# Altium project STM32F303VCT6_PLC.PrjPcb (part 2 of 2)

## Sheet 08_INPUTCAPTURE_ENCODER.SchDoc
size 420 x 297 mm; SheetNumber: 8; SheetTotal: 12
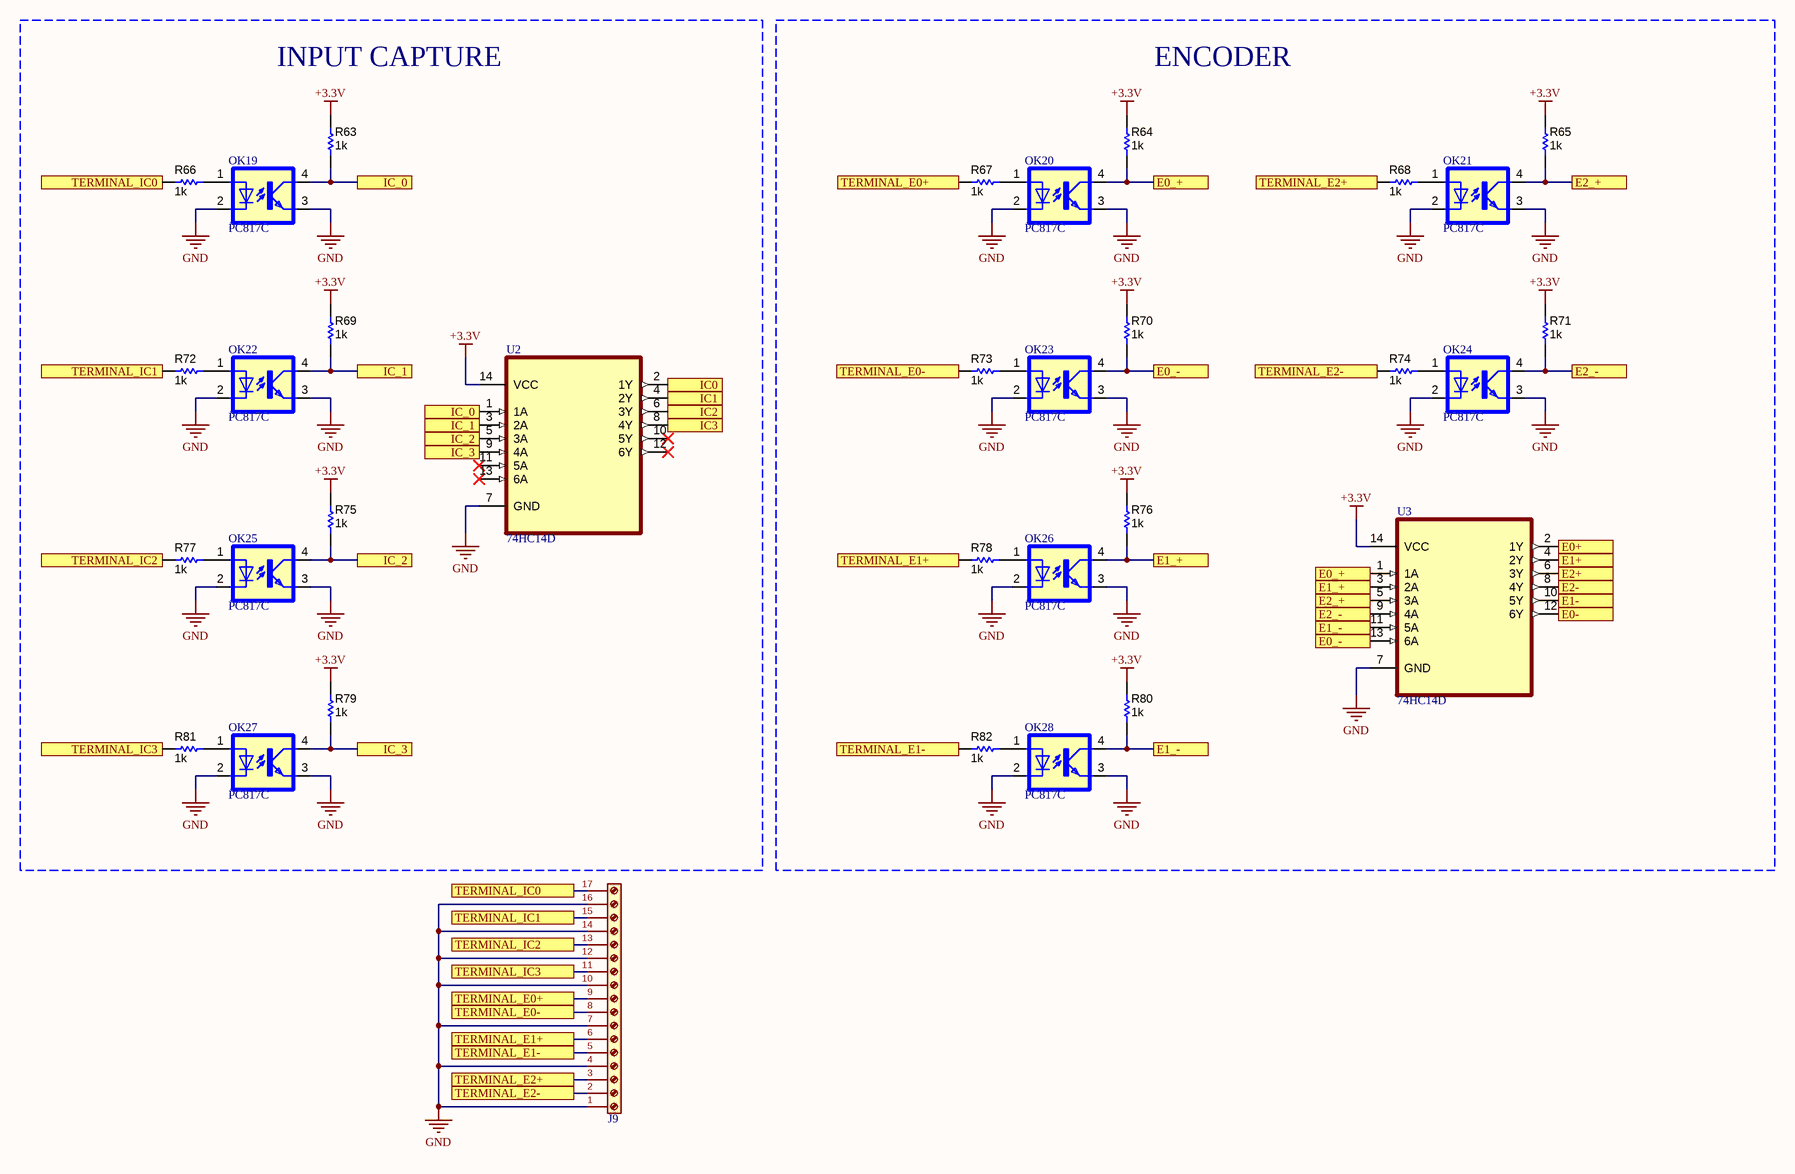
[diagram p5: 08_INPUTCAPTURE_ENCODER.SchDoc]

### Parts
J9  Terminal_01x17_P5.00  [TerminalBlock_Phoenix_PT-1,5-17-5.0-H_1x17_P5.00mm_Horizontal]  (value not drawn)
OK19  PC817C  [SOP254P975X460-4N]
OK20  PC817C  [SOP254P975X460-4N]
OK21  PC817C  [SOP254P975X460-4N]
OK22  PC817C  [SOP254P975X460-4N]
OK23  PC817C  [SOP254P975X460-4N]
OK24  PC817C  [SOP254P975X460-4N]
OK25  PC817C  [SOP254P975X460-4N]
OK26  PC817C  [SOP254P975X460-4N]
OK27  PC817C  [SOP254P975X460-4N]
OK28  PC817C  [SOP254P975X460-4N]
R63  ValueDisplayed: 1k  [0603]  (hidden comment: MCT06030Z0000ZP500)
R64  ValueDisplayed: 1k  [0603]  (hidden comment: MCT06030Z0000ZP500)
R65  ValueDisplayed: 1k  [0603]  (hidden comment: MCT06030Z0000ZP500)
R66  ValueDisplayed: 1k  [0603]  (hidden comment: MCT06030Z0000ZP500)
R67  ValueDisplayed: 1k  [0603]  (hidden comment: MCT06030Z0000ZP500)
R68  ValueDisplayed: 1k  [0603]  (hidden comment: MCT06030Z0000ZP500)
R69  ValueDisplayed: 1k  [0603]  (hidden comment: MCT06030Z0000ZP500)
R70  ValueDisplayed: 1k  [0603]  (hidden comment: MCT06030Z0000ZP500)
R71  ValueDisplayed: 1k  [0603]  (hidden comment: MCT06030Z0000ZP500)
R72  ValueDisplayed: 1k  [0603]  (hidden comment: MCT06030Z0000ZP500)
R73  ValueDisplayed: 1k  [0603]  (hidden comment: MCT06030Z0000ZP500)
R74  ValueDisplayed: 1k  [0603]  (hidden comment: MCT06030Z0000ZP500)
R75  ValueDisplayed: 1k  [0603]  (hidden comment: MCT06030Z0000ZP500)
R76  ValueDisplayed: 1k  [0603]  (hidden comment: MCT06030Z0000ZP500)
R77  ValueDisplayed: 1k  [0603]  (hidden comment: MCT06030Z0000ZP500)
R78  ValueDisplayed: 1k  [0603]  (hidden comment: MCT06030Z0000ZP500)
R79  ValueDisplayed: 1k  [0603]  (hidden comment: MCT06030Z0000ZP500)
R80  ValueDisplayed: 1k  [0603]  (hidden comment: MCT06030Z0000ZP500)
R81  ValueDisplayed: 1k  [0603]  (hidden comment: MCT06030Z0000ZP500)
R82  ValueDisplayed: 1k  [0603]  (hidden comment: MCT06030Z0000ZP500)
U2  74HC14D  [SOIC127P600X175-14N]
U3  74HC14D  [SOIC127P600X175-14N]

### Blocks framed on the sheet
INPUT CAPTURE: OK19 OK22 OK25 OK27 R63 R66 R69 R72 R75 R77 R79 R81 U2
ENCODER: OK20 OK21 OK23 OK24 OK26 OK28 R64 R65 R67 R68 R70 R71 R73 R74 R76 R78 R80 R82 U3

### Ports
E0+ (see 04_STM32F303VCT6[3C]), E0- (see 04_STM32F303VCT6[3B]), E0_+ (see 08_INPUTCAPTURE_ENCODER[4A]), E0_+ (see 08_INPUTCAPTURE_ENCODER[4B]), E0_- (see 08_INPUTCAPTURE_ENCODER[4B]), E1+ (see 04_STM32F303VCT6[5B]), E1- (see 04_STM32F303VCT6[5B]), E1_+ (see 08_INPUTCAPTURE_ENCODER[4B]), E1_- (see 08_INPUTCAPTURE_ENCODER[4B]), E2+ (see 04_STM32F303VCT6[5B]), E2- (see 04_STM32F303VCT6[5B]), E2_+ (see 08_INPUTCAPTURE_ENCODER[4B]), E2_+ (see 08_INPUTCAPTURE_ENCODER[5A]), E2_- (see 08_INPUTCAPTURE_ENCODER[4B]), E2_- (see 08_INPUTCAPTURE_ENCODER[5B]), IC0 (see 04_STM32F303VCT6[3C]), IC1 (see 04_STM32F303VCT6[3C]), IC2 (see 04_STM32F303VCT6[3B]), IC3 (see 04_STM32F303VCT6[3B]), IC_0 (see 08_INPUTCAPTURE_ENCODER[2A]), IC_0 (see 08_INPUTCAPTURE_ENCODER[2B]), IC_1 (see 08_INPUTCAPTURE_ENCODER[2B]), IC_2 (see 08_INPUTCAPTURE_ENCODER[2B]), IC_3 (see 08_INPUTCAPTURE_ENCODER[2B]), TERMINAL_E0+ (see 08_INPUTCAPTURE_ENCODER[2C]), TERMINAL_E0+ (see 08_INPUTCAPTURE_ENCODER[3A]), TERMINAL_E0- (see 08_INPUTCAPTURE_ENCODER[2C]), TERMINAL_E0- (see 08_INPUTCAPTURE_ENCODER[3B]), TERMINAL_E1+ (see 08_INPUTCAPTURE_ENCODER[2C]), TERMINAL_E1+ (see 08_INPUTCAPTURE_ENCODER[3B]), TERMINAL_E1- (see 08_INPUTCAPTURE_ENCODER[2C]), TERMINAL_E1- (see 08_INPUTCAPTURE_ENCODER[3B]), TERMINAL_E2+ (see 08_INPUTCAPTURE_ENCODER[2C]), TERMINAL_E2+ (see 08_INPUTCAPTURE_ENCODER[4A]), TERMINAL_E2- (see 08_INPUTCAPTURE_ENCODER[2C]), TERMINAL_E2- (see 08_INPUTCAPTURE_ENCODER[4B]), TERMINAL_IC0 (see 08_INPUTCAPTURE_ENCODER[1A]), TERMINAL_IC0 (see 08_INPUTCAPTURE_ENCODER[2C]), TERMINAL_IC1 (see 08_INPUTCAPTURE_ENCODER[1B]), TERMINAL_IC1 (see 08_INPUTCAPTURE_ENCODER[2C]), TERMINAL_IC2 (see 08_INPUTCAPTURE_ENCODER[1B]), TERMINAL_IC2 (see 08_INPUTCAPTURE_ENCODER[2C]), TERMINAL_IC3 (see 08_INPUTCAPTURE_ENCODER[1B]), TERMINAL_IC3 (see 08_INPUTCAPTURE_ENCODER[2C])

### Nets
+3.3V: R63.2 R64.2 R65.2 R69.2 R70.2 R71.2 R75.2 R76.2 R79.2 R80.2 U2.14(VCC) U3.14(VCC)
GND: J9.1(Pin_1) J9.4(Pin_4) J9.7(Pin_7) J9.10(Pin_10) J9.12(Pin_12) J9.14(Pin_14) J9.16(Pin_16) OK19.2(C) OK19.3(EMIT) OK20.2(C) OK20.3(EMIT) OK21.2(C) OK21.3(EMIT) OK22.2(C) OK22.3(EMIT) OK23.2(C) OK23.3(EMIT) OK24.2(C) OK24.3(EMIT) OK25.2(C) OK25.3(EMIT) OK26.2(C) OK26.3(EMIT) OK27.2(C) OK27.3(EMIT) OK28.2(C) OK28.3(EMIT) U2.7(GND) U3.7(GND)
E0+: U3.2(1Y) ; port E0+
E0-: U3.12(6Y) ; port E0-
E0_+: OK20.4(COL) R64.1 U3.1(1A) ; port E0_+
E0_-: OK23.4(COL) R70.1 U3.13(6A) ; port E0_-
E1+: U3.4(2Y) ; port E1+
E1-: U3.10(5Y) ; port E1-
E1_+: OK26.4(COL) R76.1 U3.3(2A) ; port E1_+
E1_-: OK28.4(COL) R80.1 U3.11(5A) ; port E1_-
E2+: U3.6(3Y) ; port E2+
E2-: U3.8(4Y) ; port E2-
E2_+: OK21.4(COL) R65.1 U3.5(3A) ; port E2_+
E2_-: OK24.4(COL) R71.1 U3.9(4A) ; port E2_-
IC0: U2.2(1Y) ; port IC0
IC1: U2.4(2Y) ; port IC1
IC2: U2.6(3Y) ; port IC2
IC3: U2.8(4Y) ; port IC3
IC_0: OK19.4(COL) R63.1 U2.1(1A) ; port IC_0
IC_1: OK22.4(COL) R69.1 U2.3(2A) ; port IC_1
IC_2: OK25.4(COL) R75.1 U2.5(3A) ; port IC_2
IC_3: OK27.4(COL) R79.1 U2.9(4A) ; port IC_3
TERMINAL_E0+: J9.9(Pin_9) R67.1 ; port TERMINAL_E0+
TERMINAL_E0-: J9.8(Pin_8) R73.1 ; port TERMINAL_E0-
TERMINAL_E1+: J9.6(Pin_6) R78.1 ; port TERMINAL_E1+
TERMINAL_E1-: J9.5(Pin_5) R82.1 ; port TERMINAL_E1-
TERMINAL_E2+: J9.3(Pin_3) R68.1 ; port TERMINAL_E2+
TERMINAL_E2-: J9.2(Pin_2) R74.1 ; port TERMINAL_E2-
TERMINAL_IC0: J9.17(Pin_17) R66.1 ; port TERMINAL_IC0
TERMINAL_IC1: J9.15(Pin_15) R72.1 ; port TERMINAL_IC1
TERMINAL_IC2: J9.13(Pin_13) R77.1 ; port TERMINAL_IC2
TERMINAL_IC3: J9.11(Pin_11) R81.1 ; port TERMINAL_IC3
NetOK19_1: OK19.1(A) R66.2
NetOK20_1: OK20.1(A) R67.2
NetOK21_1: OK21.1(A) R68.2
NetOK22_1: OK22.1(A) R72.2
NetOK23_1: OK23.1(A) R73.2
NetOK24_1: OK24.1(A) R74.2
NetOK25_1: OK25.1(A) R77.2
NetOK26_1: OK26.1(A) R78.2
NetOK27_1: OK27.1(A) R81.2
NetOK28_1: OK28.1(A) R82.2

Not connected (* = marked no-connect by the designer): U2 10(5Y)* 11(5A)* 12(6Y)* 13(6A)*

### Notes on the sheet
- Sub-system:
- Project:
- Design by:
- Sheet title:
- Sheet
- of
- Checked by:
- Approved by:
- Doc No:
- Revision:
- Size:
- Date:
- A3

### Library data of the parts
OK19-OK28 = PC817C: RF Mixer IC Cellular, DCS, PCS, W-CDMA, WLAN Up Converter 50MHz ~ 400MHz 6-SuperMiniMold; MF: Renesas Electronics America Inc; MP: PC817; SnapEDA_Link: https://www.snapeda.com/parts/PC817/Renesas/view-part/?ref=snap; Package: None; Value: *; Check_prices: https://www.snapeda.com/parts/PC817/Renesas/view-part/?ref=eda
R63-R82 = RES 0R 0603: RES, 0, 5%, 0.125 W, 0603; Manufacturer: Vishay/Beyschlag; Power_W: 125mW; TempCo: ppm/C; Value_Code: 0000; U/M: EA; Value: 0; EIA_Code: E24; SizeX_mm: 1.6; SizeY_mm: 0.8; SizeZ_mm: 1; Value2: 0.125W; SizeArea_mm2: 1.28; CompType: Resistor; AEC Qualified: N; AEC Category: Q200; Supplier Part Number 2: 96Y9454; Publisher: Texas Instruments; Supplier 2: Newark; Supplier Part Number 3: 594-MCT06030Z0000ZP5; Supplier 3: Mouser; Published: 2008-06-26; RoHS: Y; Value1: 5%; MountType: SMT; Supplier 1: Digi-Key; PackageReference: 0603; Tolerance_%: 5%; Res_ohm: 0; LatestRevisionDate: 2017-03-09; PartNumber: MCT06030Z0000ZP500; ComponentLink1Description: Datasheet link; AEC Grade: N/A; Supplier Part Number 1: MCT0603-0.0-ZZCT-ND; Technology: Thin Film; ComponentLink1URL: http://www.vishay.com/docs/28705/mcx0x0xpro.pdf
U2 U3 = 74HC14D: Inverter IC 6 Channel Schmitt Trigger 14-SOIC; MF: Toshiba; SnapEDA_Link: https://www.snapeda.com/parts/74HC14D/Toshiba/view-part/?ref=snap; Package: SO14-14 Nexperia USA Inc.; Value: *; MP: 74HC14D; Check_prices: https://www.snapeda.com/parts/74HC14D/Toshiba/view-part/?ref=eda

## Sheet 09_CAN.SchDoc
size 420 x 297 mm; SheetNumber: 9; SheetTotal: 12
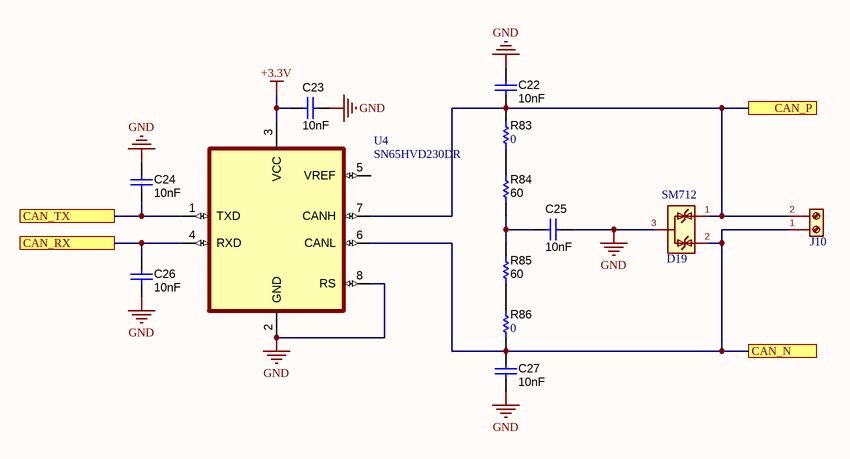
[diagram p6: 09_CAN.SchDoc]

### Parts
C22  ValueDisplayed: 10nF  [0603]  (hidden comment: CAP 10nF 0603)
C23  ValueDisplayed: 10nF  [0603]  (hidden comment: CAP 10nF 0603)
C24  ValueDisplayed: 10nF  [0603]  (hidden comment: CAP 10nF 0603)
C25  ValueDisplayed: 10nF  [0603]  (hidden comment: CAP 10nF 0603)
C26  ValueDisplayed: 10nF  [0603]  (hidden comment: CAP 10nF 0603)
C27  ValueDisplayed: 10nF  [0603]  (hidden comment: CAP 10nF 0603)
D19  SM712  [SOT-23]
J10  Terminal_01x02_P5.00  [TerminalBlock_Phoenix_PT-1,5-2-5.0-H_1x02_P5.00mm_Horizontal]  (value not drawn)
R83  ValueDisplayed: 0  [0402L]  (hidden comment: ERJ-2GE0R00X)
R84  ValueDisplayed: 60  [0603]  (hidden comment: MCT06030Z0000ZP500)
R85  ValueDisplayed: 60  [0603]  (hidden comment: MCT06030Z0000ZP500)
R86  ValueDisplayed: 0  [0402L]  (hidden comment: ERJ-2GE0R00X)
U4  SN65HVD230DR  [SOIC127P599X175-8N]

### Ports
CAN_N, CAN_P, CAN_RX (see 04_STM32F303VCT6[6C]), CAN_TX (see 04_STM32F303VCT6[6C])

### Nets
+3.3V: C23.2 U4.3(VCC)
GND: C22.1 C23.1 C24.1 C25.1 C26.2 C27.2 D19.3(A) U4.2(GND) U4.8(RS)
CAN_N: C27.1 D19.2(K) J10.1(Pin_1) R86.1 U4.6(CANL) ; port CAN_N
CAN_P: C22.2 D19.1(K) J10.2(Pin_2) R83.2 U4.7(CANH) ; port CAN_P
CAN_RX: C26.1 U4.4(RXD) ; port CAN_RX
CAN_TX: C24.2 U4.1(TXD) ; port CAN_TX
NetC25_2: C25.2 R84.1 R85.2
NetR83_1: R83.1 R84.2
NetR85_1: R85.1 R86.2

Not connected (* = marked no-connect by the designer): U4 5(VREF)

### Notes on the sheet
- Sub-system:
- Project:
- Design by:
- Sheet title:
- Sheet
- of
- Checked by:
- Approved by:
- Doc No:
- Revision:
- Size:
- Date:
- A3

### Library data of the parts
C22-C27 = CAP 10nF 0603: CAP, CERM, 10 nF, 50 V, +/- 10%, X7R, AEC-Q200 Grade 1, 0603; Manufacturer: MuRata; PartNumber: GCM188R70J225KE22D; TaMin_C: -55°C; Polarized: N; SizeAreaWB_mm2: 4.68; Value1: Unknown; U/M: EA; Value: 2.2uF; TaMax_C: 125°C; SizeZ_mm: 1; SizeX_mm: 1.6; SizeY_mm: 0.8; Value2: 6.3V; SizeArea_mm2: 1.28; CompType: Capacitor; AEC Qualified: Y; Cap_F: 2.2µF; AEC Category: Q200; Supplier Part Number 2: 81-GCM188R70J225KE2D; Publisher: Texas Instruments; Supplier 2: Mouser; TempCo: X7R; Published: 2008-06-19; RoHS: Y; MountType: SMT; Supplier 1: Digi-Key; PackageReference: 0603; Tolerance_%: 10%; Cap_Case: 0603; LatestRevisionDate: 2017-03-09; VDC_V: 6.3V; ComponentLink1Description: Datasheet link; AEC Grade: 1; Supplier Part Number 1: 490-5316-1-ND; Technology: Ceramic; ComponentLink1URL: http://psearch.en.murata.com/capacitor/product/GCM188R70J225KE22%23.pdf
D19 = PESD5V0L2BT,215
R83 R86 = RES 0R 0402 0.1W: RES, 0, 5%, 0.1 W, AEC-Q200 Grade 0, 0402; Manufacturer: Panasonic; Power_W: 100mW; TempCo: 600 ppm/C; Value_Code: 0000; Value: 0; EIA_Code: E24; SizeX_mm: 1; SizeY_mm: 0.5; SizeZ_mm: 0.6; Value2: 0.1W; CompType: Resistor; AEC Qualified: Y; VDC_V: 50V; AEC Category: Q200; SizeAreaWB_mm2: 3; Supplier Part Number 2: 65T8307; Supplier 2: Newark; Supplier Part Number 3: 667-ERJ-2GE0R00X; Supplier 3: Mouser; RoHS: Y; Value1: 5%; MountType: SMT; Supplier 1: Digi-Key; PackageReference: 0402; Tolerance_%: 5%; Res_ohm: 0; SizeArea_mm2: 0.5; PartNumber: ERJ-2GE0R00X; ComponentLink1Description: Datasheet link; Supplier Part Number 1: P0.0JCT-ND; Technology: Thick Film; ComponentLink1URL: https://industrial.panasonic.com/cdbs/www-data/pdf/RDA0000/AOA0000C301.pdf; AEC Grade: 0
R84 R85 = RES 60R 0603: RES, 60, 5%, 0.125 W, 0603; Manufacturer: Vishay/Beyschlag; Power_W: 125mW; TempCo: ppm/C; Value_Code: 0000; U/M: EA; Value: 0; EIA_Code: E24; SizeX_mm: 1.6; SizeY_mm: 0.8; SizeZ_mm: 1; Value2: 0.125W; SizeArea_mm2: 1.28; CompType: Resistor; AEC Qualified: N; AEC Category: Q200; Supplier Part Number 2: 96Y9454; Publisher: Texas Instruments; Supplier 2: Newark; Supplier Part Number 3: 594-MCT06030Z0000ZP5; Supplier 3: Mouser; Published: 2008-06-26; RoHS: Y; Value1: 5%; MountType: SMT; Supplier 1: Digi-Key; PackageReference: 0603; Tolerance_%: 5%; Res_ohm: 0; LatestRevisionDate: 2017-03-09; PartNumber: MCT06030Z0000ZP500; ComponentLink1Description: Datasheet link; AEC Grade: N/A; Supplier Part Number 1: MCT0603-0.0-ZZCT-ND; Technology: Thin Film; ComponentLink1URL: http://www.vishay.com/docs/28705/mcx0x0xpro.pdf
U4 = SN65HVD230DR_1: 3.3-V CAN Transceivers; MF: Texas Instruments; MP: TCAN332DR; SnapEDA_Link: https://www.snapeda.com/parts/TCAN332DR/Texas+Instruments/view-part/?ref=snap; Package: SOIC-8 Texas Instruments; Value: *; Check_prices: https://www.snapeda.com/parts/TCAN332DR/Texas+Instruments/view-part/?ref=eda

## Sheet 10_ADC.SchDoc
size 420 x 297 mm; SheetNumber: 10; SheetTotal: 12
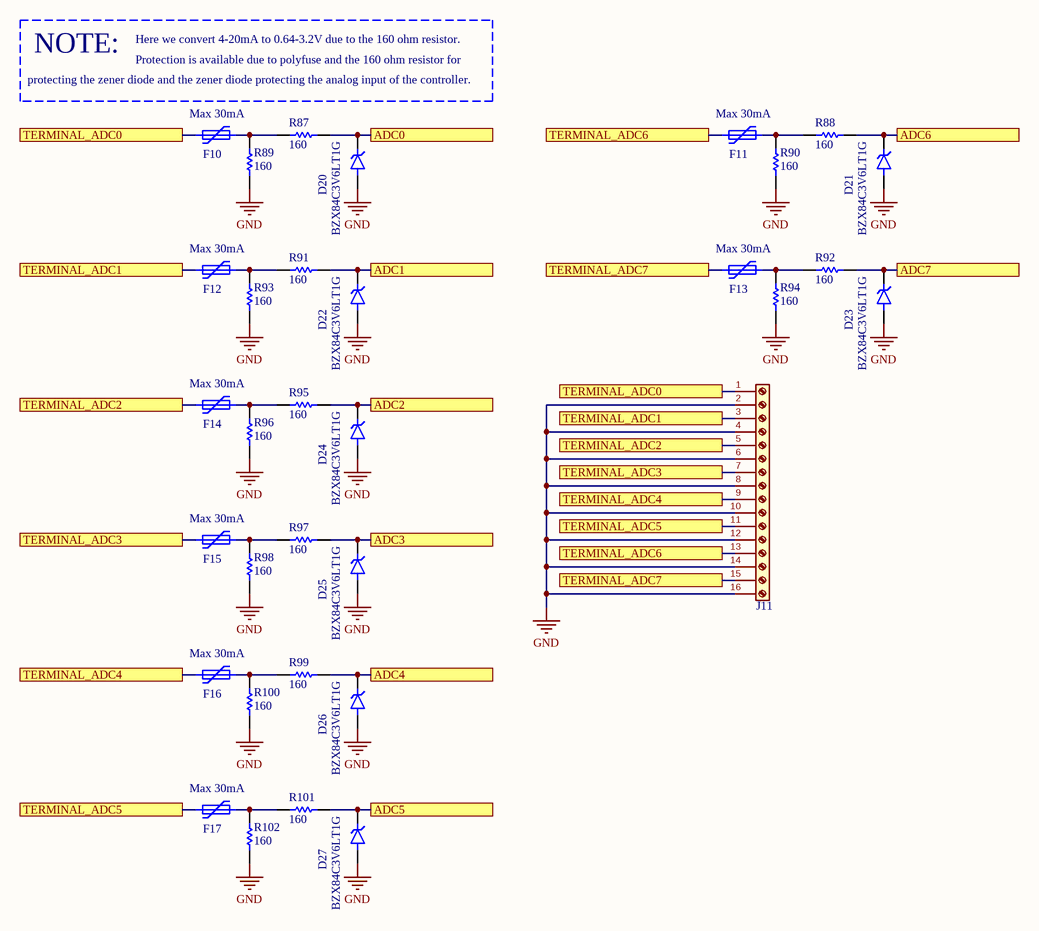
[diagram p7: 10_ADC.SchDoc]

### Parts
D20  BZX84C3V6LT1G  [SOT95P240X111-3N]
D21  BZX84C3V6LT1G  [SOT95P240X111-3N]
D22  BZX84C3V6LT1G  [SOT95P240X111-3N]
D23  BZX84C3V6LT1G  [SOT95P240X111-3N]
D24  BZX84C3V6LT1G  [SOT95P240X111-3N]
D25  BZX84C3V6LT1G  [SOT95P240X111-3N]
D26  BZX84C3V6LT1G  [SOT95P240X111-3N]
D27  BZX84C3V6LT1G  [SOT95P240X111-3N]
F10  Max 30mA  [Fuse_0603_1608Metric]
F11  Max 30mA  [Fuse_0603_1608Metric]
F12  Max 30mA  [Fuse_0603_1608Metric]
F13  Max 30mA  [Fuse_0603_1608Metric]
F14  Max 30mA  [Fuse_0603_1608Metric]
F15  Max 30mA  [Fuse_0603_1608Metric]
F16  Max 30mA  [Fuse_0603_1608Metric]
F17  Max 30mA  [Fuse_0603_1608Metric]
J11  Terminal_01x16_P5.00  [TerminalBlock_Phoenix_PT-1,5-16-5.0-H_1x16_P5.00mm_Horizontal]  (value not drawn)
R87  ValueDisplayed: 160  [0603]  (hidden comment: CRCW060320R0JNEA)
R88  ValueDisplayed: 160  [0603]  (hidden comment: CRCW060320R0JNEA)
R89  ValueDisplayed: 160  [0603]  (hidden comment: CRCW060320R0JNEA)
R90  ValueDisplayed: 160  [0603]  (hidden comment: CRCW060320R0JNEA)
R91  ValueDisplayed: 160  [0603]  (hidden comment: CRCW060320R0JNEA)
R92  ValueDisplayed: 160  [0603]  (hidden comment: CRCW060320R0JNEA)
R93  ValueDisplayed: 160  [0603]  (hidden comment: CRCW060320R0JNEA)
R94  ValueDisplayed: 160  [0603]  (hidden comment: CRCW060320R0JNEA)
R95  ValueDisplayed: 160  [0603]  (hidden comment: CRCW060320R0JNEA)
R96  ValueDisplayed: 160  [0603]  (hidden comment: CRCW060320R0JNEA)
R97  ValueDisplayed: 160  [0603]  (hidden comment: CRCW060320R0JNEA)
R98  ValueDisplayed: 160  [0603]  (hidden comment: CRCW060320R0JNEA)
R99  ValueDisplayed: 160  [0603]  (hidden comment: CRCW060320R0JNEA)
R100  ValueDisplayed: 160  [0603]  (hidden comment: CRCW060320R0JNEA)
R101  ValueDisplayed: 160  [0603]  (hidden comment: CRCW060320R0JNEA)
R102  ValueDisplayed: 160  [0603]  (hidden comment: CRCW060320R0JNEA)

### Ports
ADC0 (see 04_STM32F303VCT6[3B]), ADC1 (see 04_STM32F303VCT6[3B]), ADC2 (see 04_STM32F303VCT6[3B]), ADC3 (see 04_STM32F303VCT6[2B]), ADC4 (see 04_STM32F303VCT6[2B]), ADC5 (see 04_STM32F303VCT6[2B]), ADC6 (see 04_STM32F303VCT6[2B]), ADC7 (see 04_STM32F303VCT6[2B]), TERMINAL_ADC0 (see 10_ADC[1A]), TERMINAL_ADC0 (see 10_ADC[2B]), TERMINAL_ADC1 (see 10_ADC[1A]), TERMINAL_ADC1 (see 10_ADC[2B]), TERMINAL_ADC2 (see 10_ADC[1B]), TERMINAL_ADC2 (see 10_ADC[2B]), TERMINAL_ADC3 (see 10_ADC[1B]), TERMINAL_ADC3 (see 10_ADC[2B]), TERMINAL_ADC4 (see 10_ADC[1B]), TERMINAL_ADC4 (see 10_ADC[2B]), TERMINAL_ADC5 (see 10_ADC[1C]), TERMINAL_ADC5 (see 10_ADC[2B]), TERMINAL_ADC6 (see 10_ADC[2A]), TERMINAL_ADC6 (see 10_ADC[2B]), TERMINAL_ADC7 (see 10_ADC[2A]), TERMINAL_ADC7 (see 10_ADC[2B])

### Nets
GND: D20.1(A) D21.1(A) D22.1(A) D23.1(A) D24.1(A) D25.1(A) D26.1(A) D27.1(A) J11.2(Pin_2) J11.4(Pin_4) J11.6(Pin_6) J11.8(Pin_8) J11.10(Pin_10) J11.12(Pin_12) J11.14(Pin_14) J11.16(Pin_16) R89.1 R90.1 R93.1 R94.1 R96.1 R98.1 R100.1 R102.1
ADC0: D20.3(K) R87.2 ; port ADC0
ADC1: D22.3(K) R91.2 ; port ADC1
ADC2: D24.3(K) R95.2 ; port ADC2
ADC3: D25.3(K) R97.2 ; port ADC3
ADC4: D26.3(K) R99.2 ; port ADC4
ADC5: D27.3(K) R101.2 ; port ADC5
ADC6: D21.3(K) R88.2 ; port ADC6
ADC7: D23.3(K) R92.2 ; port ADC7
TERMINAL_ADC0: F10.1 J11.1(Pin_1) ; port TERMINAL_ADC0
TERMINAL_ADC1: F12.1 J11.3(Pin_3) ; port TERMINAL_ADC1
TERMINAL_ADC2: F14.1 J11.5(Pin_5) ; port TERMINAL_ADC2
TERMINAL_ADC3: F15.1 J11.7(Pin_7) ; port TERMINAL_ADC3
TERMINAL_ADC4: F16.1 J11.9(Pin_9) ; port TERMINAL_ADC4
TERMINAL_ADC5: F17.1 J11.11(Pin_11) ; port TERMINAL_ADC5
TERMINAL_ADC6: F11.1 J11.13(Pin_13) ; port TERMINAL_ADC6
TERMINAL_ADC7: F13.1 J11.15(Pin_15) ; port TERMINAL_ADC7
NetF10_2: F10.2 R87.1 R89.2
NetF11_2: F11.2 R88.1 R90.2
NetF12_2: F12.2 R91.1 R93.2
NetF13_2: F13.2 R92.1 R94.2
NetF14_2: F14.2 R95.1 R96.2
NetF15_2: F15.2 R97.1 R98.2
NetF16_2: F16.2 R99.1 R100.2
NetF17_2: F17.2 R101.1 R102.2

### Notes on the sheet
- protecting the zener diode and the zener diode protecting the analog input of the controller.
- NOTE:
- Here we convert 4-20mA to 0.64-3.2V due to the 160 ohm resistor.
- Protection is available due to polyfuse and the 160 ohm resistor for
- Sub-system:
- Project:
- Design by:
- Sheet title:
- Sheet
- of
- Checked by:
- Approved by:
- Doc No:
- Revision:
- Size:
- Date:
- A3

### Library data of the parts
D20-D27 = BZX84C3V6LT1G: MP: BZX84C10LT1G; Package: None; Price: None; Value: *; Availability: Unavailable
F10-F17 = Polyfuse 0603
R87-R102 = RES 160R 0603: RES, 160, 5%, 0.1 W, AEC-Q200 Grade 0, 0603; Manufacturer: Vishay-Dale; Power_W: 100mW; TempCo: 200 ppm/C; Value_Code: 20R0; Value: 20; EIA_Code: E24; SizeX_mm: 1.6; SizeY_mm: 0.8; SizeZ_mm: 1; Value2: 0.1W; SizeArea_mm2: 1.28; CompType: Resistor; AEC Qualified: Y; VDC_V: 75V; AEC Category: Q200; AEC Grade: 0; Supplier Part Number 2: 59M6784; Supplier 2: Newark; Supplier Part Number 3: 71-CRCW0603J-20-E3; Supplier 3: Mouser; RoHS: E; Value1: 5%; MountType: SMT; Supplier 1: Digi-Key; PackageReference: 0603; Tolerance_%: 5%; Res_ohm: 20; PartNumber: CRCW060320R0JNEA; ComponentLink1Description: Datasheet link; Supplier Part Number 1: 541-20GCT-ND; Technology: Thick Film; ComponentLink1URL: http://www.vishay.com/docs/20035/dcrcwe3.pdf

## Sheet 11_DAC.SchDoc
size 420 x 297 mm; SheetNumber: 11; SheetTotal: 12
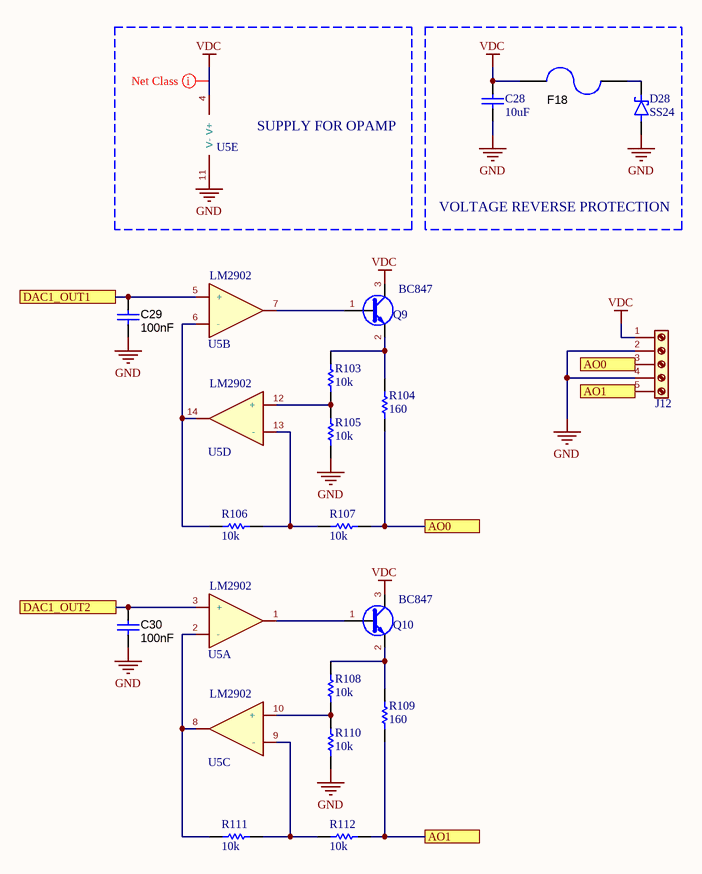
[diagram p8: 11_DAC.SchDoc]

### Parts
C28  ValueDisplayed: 10uF  [C_1206_3216Metric]  (hidden comment: CGA6P1X7R1E106M250AC)
C29  ValueDisplayed: 100nF  [0603]  (hidden comment: CAP 100nF 0603)
C30  ValueDisplayed: 100nF  [0603]  (hidden comment: CAP 100nF 0603)
D28  SS24  [DIOM5336X265N]
F18  0440005.WR  [CAPC4520X203N]  (value not drawn)
J12  Terminal_01x5_P5.00  [TerminalBlock_Phoenix_PT-1,5-5-5.0-H_1x5_P5.00mm_Horizontal]  (value not drawn)
Q9  BC847  [SOT-23]
Q10  BC847  [SOT-23]
R103  ValueDisplayed: 10k  [0603]  (hidden comment: RES 10K 0603)
R104  ValueDisplayed: 160  [0603]  (hidden comment: CRCW060320R0JNEA)
R105  ValueDisplayed: 10k  [0603]  (hidden comment: RES 10K 0603)
R106  ValueDisplayed: 10k  [0603]  (hidden comment: RES 10K 0603)
R107  ValueDisplayed: 10k  [0603]  (hidden comment: RES 10K 0603)
R108  ValueDisplayed: 10k  [0603]  (hidden comment: RES 10K 0603)
R109  ValueDisplayed: 160  [0603]  (hidden comment: CRCW060320R0JNEA)
R110  ValueDisplayed: 10k  [0603]  (hidden comment: RES 10K 0603)
R111  ValueDisplayed: 10k  [0603]  (hidden comment: RES 10K 0603)
R112  ValueDisplayed: 10k  [0603]  (hidden comment: RES 10K 0603)
U5  LM2902  [SOIC-14_3.9x8.7mm_P1.27mm]  (parts A,B,C,D,E of 5)

### Blocks framed on the sheet
SUPPLY FOR OPAMP: U5
VOLTAGE REVERSE PROTECTION: C28 D28 F18

### Ports
AO0 (see 11_DAC[2A]), AO0 (see 11_DAC[2B]), AO1 (see 11_DAC[2B]), AO1 (see 11_DAC[2C]), DAC1_OUT1 (see 04_STM32F303VCT6[3B]), DAC1_OUT2 (see 04_STM32F303VCT6[3B])

### Nets
GND: C28.2 C29.2 C30.2 D28.A J12.2(Pin_2) J12.4(Pin_4) R105.1 R110.1 U5.11(V-)
VDC: C28.1 F18.2 J12.1(Pin_1) Q9.3(C) Q10.3(C) U5.4(V+)
AO0: J12.3(Pin_3) R104.1 R107.2 ; port AO0
AO1: J12.5(Pin_5) R109.1 R112.2 ; port AO1
DAC1_OUT1: C29.1 U5.5(+) ; port DAC1_OUT1
DAC1_OUT2: C30.1 U5.3(+) ; port DAC1_OUT2
NetD28_C: D28.C(K) F18.1
NetQ9_1: Q9.1(B) U5.7
NetQ9_2: Q9.2(E) R103.2 R104.2
NetQ10_1: Q10.1(B) U5.1
NetQ10_2: Q10.2(E) R108.2 R109.2
NetR103_1: R103.1 R105.2 U5.12(+)
NetR106_1: R106.1 U5.6(-) U5.14
NetR106_2: R106.2 R107.1 U5.13(-)
NetR108_1: R108.1 R110.2 U5.10(+)
NetR111_1: R111.1 U5.2(-) U5.8
NetR111_2: R111.2 R112.1 U5.9(-)

### Layout directives
net class PWR: VDC

### Notes on the sheet
- Sub-system:
- Project:
- Design by:
- Sheet title:
- Sheet
- of
- Checked by:
- Approved by:
- Doc No:
- Revision:
- Size:
- Date:
- A3

### Library data of the parts
C28 = CAP 10uF 1206: Manufacturer: TDK; TaMin_C: -55°C; Polarized: N; TempCo: X7R; SizeAreaWB_mm2: 14.7; Value1: Unknown; U/M: EA; Value: 10uF; TaMax_C: 125°C; Tolerance_%: 20%; SizeZ_mm: 2.8; SizeX_mm: 3.2; SizeY_mm: 2.5; Cap_Case: 1210; Value2: 25V; SizeArea_mm2: 8; CompType: Capacitor; AEC Qualified: Y; Cap_F: 10µF; AEC Grade: 1; AEC Category: Q200; Supplier Part Number 2: 810-CGA6P1X7R1E106M; Publisher: Texas Instruments; Supplier 2: Mouser; Published: 2008-06-19; RoHS: Y; MountType: SMT; Supplier 1: Digi-Key; PackageReference: 1210; LatestRevisionDate: 2017-03-09; PartNumber: CGA6P1X7R1E106M250AC; VDC_V: 25V; ComponentLink1Description: Datasheet link; Supplier Part Number 1: 445-5720-1-ND; Technology: Ceramic; ComponentLink1URL: http://product.tdk.com/en/catalog/datasheets/mlcc_automotive_general_en.pdf
C29 C30 = CAP 100nF 0603: CAP, CERM, 100 nF, 25 V, +/- 10%, X7R, AEC-Q200 Grade 1, 0603; Manufacturer: MuRata; PartNumber: GCM188R70J225KE22D; TaMin_C: -55°C; Polarized: N; SizeAreaWB_mm2: 4.68; Value1: Unknown; U/M: EA; Value: 2.2uF; TaMax_C: 125°C; SizeZ_mm: 1; SizeX_mm: 1.6; SizeY_mm: 0.8; Value2: 6.3V; SizeArea_mm2: 1.28; CompType: Capacitor; AEC Qualified: Y; Cap_F: 2.2µF; AEC Category: Q200; Supplier Part Number 2: 81-GCM188R70J225KE2D; Publisher: Texas Instruments; Supplier 2: Mouser; TempCo: X7R; Published: 2008-06-19; RoHS: Y; MountType: SMT; Supplier 1: Digi-Key; PackageReference: 0603; Tolerance_%: 10%; Cap_Case: 0603; LatestRevisionDate: 2017-03-09; VDC_V: 6.3V; ComponentLink1Description: Datasheet link; AEC Grade: 1; Supplier Part Number 1: 490-5316-1-ND; Technology: Ceramic; ComponentLink1URL: http://psearch.en.murata.com/capacitor/product/GCM188R70J225KE22%23.pdf
D28 = SS24: Diode Schottky 40V 2A Surface Mount DO-214AA (SMB); MF: ON Semiconductor; Package: DO-214AA ON Semiconductor; Price: None; Value: *; SnapEDA_Link: https://www.snapeda.com/parts/SS24/Onsemi/view-part/?ref=snap; MP: SS24; Availability: In Stock; Check_prices: https://www.snapeda.com/parts/SS24/Onsemi/view-part/?ref=eda
F18 = FUSE 1808: Fuse, 5 A, 32VAC/VDC, SMD; Manufacturer: Littelfuse; Irating_A: 5A; SizeAreaWB_mm2: 10.92; Interrupt_AC: 50A; VAC_V: 32V; SizeZ_mm: 1.35; SizeX_mm: 3.2; SizeY_mm: 1.6; SizeArea_mm2: 5.12; Rtyp_Ohm: 0.012; MeltingTyp: 4.761; ComponentLink1URL: http://www.littelfuse.com/~/media/electronics/datasheets/fuses/littelfuse_fuse_440_datasheet.pdf.pdf; Supplier Part Number 2: 64R8013; Supplier 2: Newark; Supplier Part Number 3: 576-0440005.WR; Supplier 3: Mouser; RoHS: Y; MountType: SMT; Interrupt_DC: 50A; Supplier 1: Digi-Key; PackageReference: 1206; CompType: Fuse; PartNumber: 0440005.WR; VDC_V: 32V; ComponentLink1Description: Datasheet URL; Supplier Part Number 1: F1608CT-ND
R103 R105-R108 R110-R112 = RES 10K 0603 1%: RES, 10K, 1%, 0.1 W, AEC-Q200 Grade 0, 0603; Manufacturer: Vishay-Dale; PartNumber: CRCW060320R0JNEA; Power_W: 100mW; TempCo: 200 ppm/C; Value_Code: 20R0; Value1: 5%; Value: 20; EIA_Code: E24; SizeX_mm: 1.6; SizeY_mm: 0.8; SizeZ_mm: 1; Value2: 0.1W; SizeArea_mm2: 1.28; CompType: Resistor; AEC Qualified: Y; VDC_V: 75V; AEC Category: Q200; AEC Grade: 0; Supplier Part Number 2: 59M6784; Supplier 2: Newark; Supplier Part Number 3: 71-CRCW0603J-20-E3; Supplier 3: Mouser; RoHS: E; MountType: SMT; Supplier 1: Digi-Key; PackageReference: 0603; Tolerance_%: 5%; Res_ohm: 20; ComponentLink1Description: Datasheet link; Supplier Part Number 1: 541-20GCT-ND; Technology: Thick Film; ComponentLink1URL: http://www.vishay.com/docs/20035/dcrcwe3.pdf
R104 R109 = RES 160R 0603: as R87 on sheet 10_ADC; Supplier Part Number 2: 59M6784; Supplier 2: Newark; Supplier Part Number 3: 71-CRCW0603J-20-E3; Supplier 3: Mouser; RoHS: E; Value1: 5%; MountType: SMT; Supplier 1: Digi-Key; PackageReference: 0603; Tolerance_%: 5%; Res_ohm: 20; PartNumber: CRCW060320R0JNEA; ComponentLink1Description: Datasheet link; Supplier Part Number 1: 541-20GCT-ND; Technology: Thick Film; ComponentLink1URL: http://www.vishay.com/docs/20035/dcrcwe3.pdf

## Sheet 12_LED.SchDoc
size 420 x 297 mm; SheetNumber: 12; SheetTotal: 12
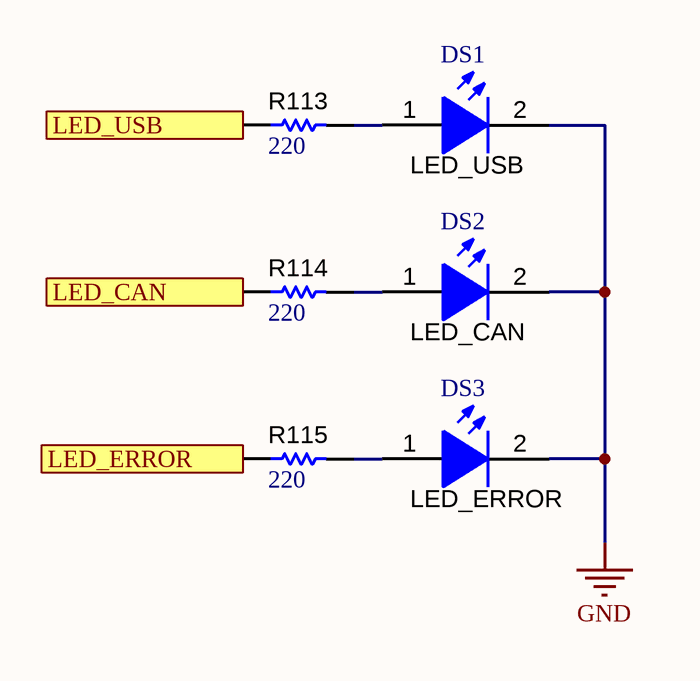
[diagram p9: 12_LED.SchDoc]

### Parts
DS1  value LED_USB  [LS L29K_Red]  (hidden comment: LS L29K-G1J2-1-Z)
DS2  value LED_CAN  [LS L29K_Red]  (hidden comment: LS L29K-G1J2-1-Z)
DS3  value LED_ERROR  [LS L29K_Red]  (hidden comment: LS L29K-G1J2-1-Z)
R113  ValueDisplayed: 220  [0402L]  (hidden comment: CRCW04021K00FKED)
R114  ValueDisplayed: 220  [0402L]  (hidden comment: CRCW04021K00FKED)
R115  ValueDisplayed: 220  [0402L]  (hidden comment: CRCW04021K00FKED)

### Ports
LED_CAN (see 04_STM32F303VCT6[6B]), LED_ERROR (see 04_STM32F303VCT6[6B]), LED_USB (see 04_STM32F303VCT6[4C])

### Nets
GND: DS1.2(K) DS2.2(K) DS3.2(K)
LED_CAN: R114.1 ; port LED_CAN
LED_ERROR: R115.1 ; port LED_ERROR
LED_USB: R113.1 ; port LED_USB
NetDS1_1: DS1.1(A) R113.2
NetDS2_1: DS2.1(A) R114.2
NetDS3_1: DS3.1(A) R115.2

### Notes on the sheet
- Sub-system:
- Project:
- Design by:
- Sheet title:
- Sheet
- of
- Checked by:
- Approved by:
- Doc No:
- Revision:
- Size:
- Date:
- A3

### Library data of the parts
DS1-DS3 = LED RED SMD: LED, Red, SMD; Manufacturer: OSRAM; Io_A: 20mA; Vr_V: 12V; Tjmax_C: 110°C; Value1: W; Angle: 160; Vf_V: 1.8V; ComponentLink1URL: http://www.osram-os.com/Graphics/XPic2/00077099_0.pdf; Color: Red; RoHS: Y; MountType: SMT; PackageReference: SMD, 2-Leads, Body 1.3x0.8mm; Value2: 1.8V; CompType: LED; Type: ?; PartNumber: LS L29K-G1J2-1-Z; ComponentLink1Description: Datasheet link
R113-R115 = RES 1K 0402: RES, 1.00 k, 1%, 0.063 W, AEC-Q200 Grade 0, 0402; Manufacturer: Vishay-Dale; Power_W: 63mW; TempCo: 100 ppm/C; Value_Code: 1k00; Value: 1.00k; EIA_Code: E96; Res_ohm: 1k; SizeX_mm: 1; SizeY_mm: 0.5; SizeZ_mm: 0.6; Value2: 0.063W; CompType: Resistor; AEC Qualified: Y; VDC_V: 50V; AEC Category: Q200; AEC Grade: 0; Supplier Part Number 2: 52K6545; Supplier 2: Newark; Supplier Part Number 3: 71-CRCW0402-1.0K-E3; Supplier 3: Mouser; RoHS: E; Value1: 1%; MountType: SMT; Supplier 1: Digi-Key; PackageReference: 0402; Tolerance_%: 1%; SizeArea_mm2: 0.5; PartNumber: CRCW04021K00FKED; ComponentLink1Description: Datasheet link; Supplier Part Number 1: 541-1.00KLCT-ND; Technology: Thick Film; ComponentLink1URL: http://www.vishay.com/docs/20035/dcrcwe3.pdf

## Nets that join several sheets
+3.3V: 04_STM32F303VCT6 (26 pins), 05_INPUT (10 pins), 08_INPUTCAPTURE_ENCODER (12 pins), 09_CAN (C23.2 U4.3)
+5V: 04_STM32F303VCT6 (6 pins), 05_INPUT (10 pins), 06_DIGITAL (24 pins)
GND: 04_STM32F303VCT6 (44 pins), 05_INPUT (30 pins), 06_DIGITAL (24 pins), 07_DADC (20 pins), 08_INPUTCAPTURE_ENCODER (29 pins), 09_CAN (9 pins), 10_ADC (24 pins), 11_DAC (9 pins), 12_LED (DS1.2 DS2.2 DS3.2)
ADC0: 04_STM32F303VCT6 (U1.35), 10_ADC (D20.3 R87.2)
ADC1: 04_STM32F303VCT6 (U1.36), 10_ADC (D22.3 R91.2)
ADC2: 04_STM32F303VCT6 (U1.37), 10_ADC (D24.3 R95.2)
ADC3: 04_STM32F303VCT6 (U1.38), 10_ADC (D25.3 R97.2)
ADC4: 04_STM32F303VCT6 (U1.39), 10_ADC (D26.3 R99.2)
ADC5: 04_STM32F303VCT6 (U1.40), 10_ADC (D27.3 R101.2)
ADC6: 04_STM32F303VCT6 (U1.41), 10_ADC (D21.3 R88.2)
ADC7: 04_STM32F303VCT6 (U1.44), 10_ADC (D23.3 R92.2)
CAN_RX: 04_STM32F303VCT6 (U1.81), 09_CAN (C26.1 U4.4)
CAN_TX: 04_STM32F303VCT6 (U1.82), 09_CAN (C24.2 U4.1)
DAC1_OUT1: 04_STM32F303VCT6 (U1.29), 11_DAC (C29.1 U5.5)
DAC1_OUT2: 04_STM32F303VCT6 (U1.30), 11_DAC (C30.1 U5.3)
DADC0N: 04_STM32F303VCT6 (U1.43), 07_DADC (D13.3 R51.2)
DADC0P: 04_STM32F303VCT6 (U1.42), 07_DADC (D11.3 R47.2)
DADC1N: 04_STM32F303VCT6 (U1.46), 07_DADC (D16.3 R57.2)
DADC1P: 04_STM32F303VCT6 (U1.45), 07_DADC (D15.3 R55.2)
DADC2N: 04_STM32F303VCT6 (U1.58), 07_DADC (D18.3 R61.2)
DADC2P: 04_STM32F303VCT6 (U1.57), 07_DADC (D17.3 R59.2)
DADC3N: 04_STM32F303VCT6 (U1.60), 07_DADC (D14.3 R52.2)
DADC3P: 04_STM32F303VCT6 (U1.59), 07_DADC (D12.3 R48.2)
DI0: 04_STM32F303VCT6 (U1.5), 05_INPUT (OK1.4 R4.1)
DI1: 04_STM32F303VCT6 (U1.4), 05_INPUT (OK3.4 R8.1)
DI2: 04_STM32F303VCT6 (U1.3), 05_INPUT (OK5.4 R12.1)
DI3: 04_STM32F303VCT6 (U1.1), 05_INPUT (OK7.4 R16.1)
DI4: 04_STM32F303VCT6 (U1.2), 05_INPUT (OK9.4 R20.1)
DI5: 04_STM32F303VCT6 (U1.98), 05_INPUT (OK2.4 R6.1)
DI6: 04_STM32F303VCT6 (U1.97), 05_INPUT (OK4.4 R10.1)
DI7: 04_STM32F303VCT6 (U1.88), 05_INPUT (OK6.4 R14.1)
DI8: 04_STM32F303VCT6 (U1.87), 05_INPUT (OK8.4 R18.1)
DI9: 04_STM32F303VCT6 (U1.86), 05_INPUT (OK10.4 R22.1)
DO0: 04_STM32F303VCT6 (U1.15), 06_DIGITAL (R23.2)
DO1: 04_STM32F303VCT6 (U1.16), 06_DIGITAL (R29.2)
DO2: 04_STM32F303VCT6 (U1.17), 06_DIGITAL (R35.2)
DO3: 04_STM32F303VCT6 (U1.18), 06_DIGITAL (R41.2)
DO4: 04_STM32F303VCT6 (U1.19), 06_DIGITAL (R24.2)
DO5: 04_STM32F303VCT6 (U1.23), 06_DIGITAL (R30.2)
DO6: 04_STM32F303VCT6 (U1.24), 06_DIGITAL (R36.2)
DO7: 04_STM32F303VCT6 (U1.27), 06_DIGITAL (R42.2)
E0+: 04_STM32F303VCT6 (U1.93), 08_INPUTCAPTURE_ENCODER (U3.2)
E0-: 04_STM32F303VCT6 (U1.92), 08_INPUTCAPTURE_ENCODER (U3.12)
E1+: 04_STM32F303VCT6 (U1.66), 08_INPUTCAPTURE_ENCODER (U3.4)
E1-: 04_STM32F303VCT6 (U1.65), 08_INPUTCAPTURE_ENCODER (U3.10)
E2+: 04_STM32F303VCT6 (U1.64), 08_INPUTCAPTURE_ENCODER (U3.6)
E2-: 04_STM32F303VCT6 (U1.63), 08_INPUTCAPTURE_ENCODER (U3.8)
IC0: 04_STM32F303VCT6 (U1.96), 08_INPUTCAPTURE_ENCODER (U2.2)
IC1: 04_STM32F303VCT6 (U1.95), 08_INPUTCAPTURE_ENCODER (U2.4)
IC2: 04_STM32F303VCT6 (U1.25), 08_INPUTCAPTURE_ENCODER (U2.6)
IC3: 04_STM32F303VCT6 (U1.26), 08_INPUTCAPTURE_ENCODER (U2.8)
LED_CAN: 04_STM32F303VCT6 (U1.33), 12_LED (R114.1)
LED_ERROR: 04_STM32F303VCT6 (U1.34), 12_LED (R115.1)
LED_USB: 04_STM32F303VCT6 (U1.32), 12_LED (R113.1)